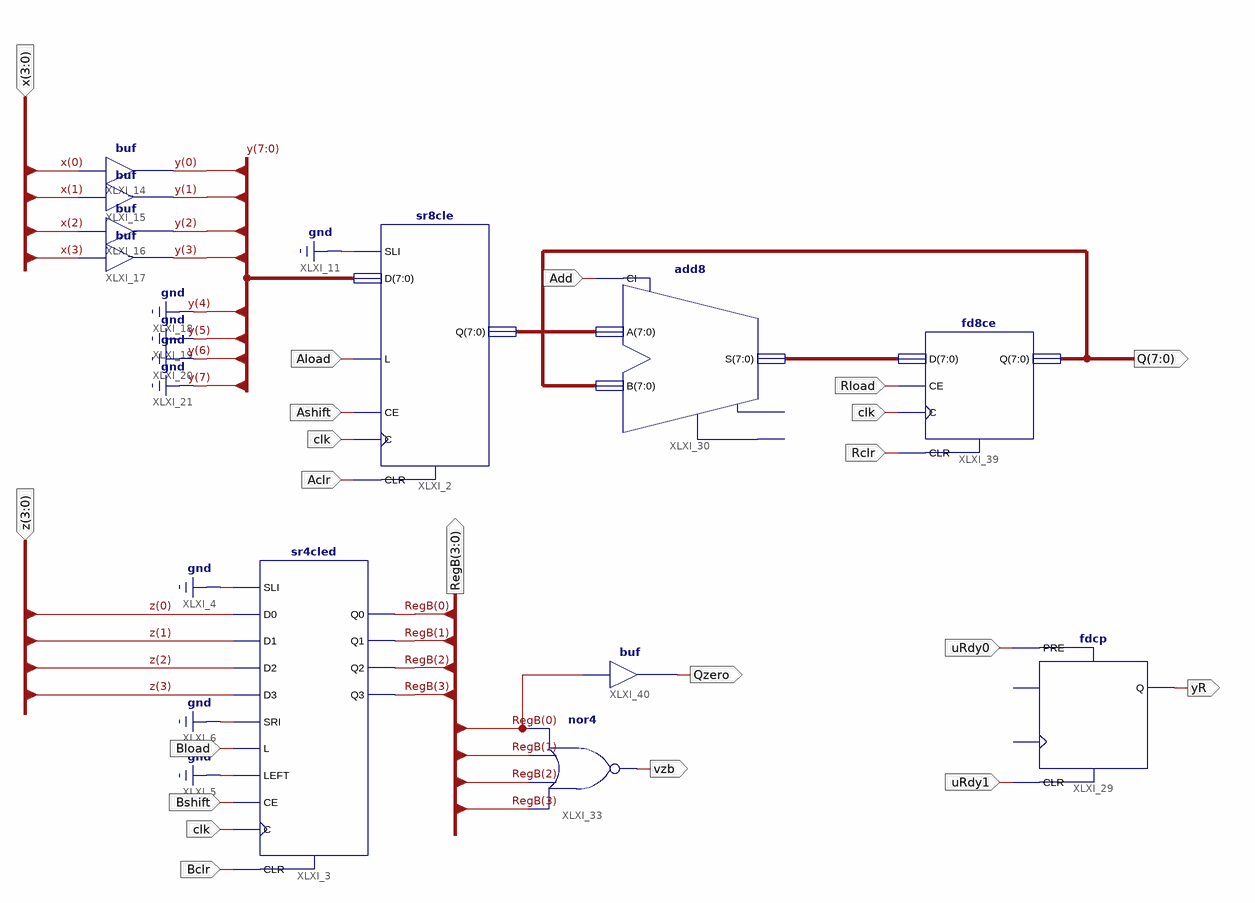
[diagram p0: schematic sheet 1]
// Xilinx ISE schematic PartC.sch (spartan3a) as structural Verilog: 11 symbols, 19 ports
module PartC (
  input  clk,
  input  [3:0] x,
  input  Bclr,
  input  Bshift,
  input  Bload,
  input  Aclr,
  input  Ashift,
  input  Aload,
  input  Add,
  input  Rload,
  input  Rclr,
  input  uRdy1,
  input  uRdy0,
  input  [3:0] z,
  output [3:0] RegB,
  output vzb,
  output [7:0] Q,
  output yR,
  output Qzero
);

  wire [3:0] y;
  wire [7:0] XLXN_75, XLXN_79;

  buf XLXI_14 (y[0], x[0]);
  buf XLXI_15 (y[1], x[1]);
  buf XLXI_16 (y[2], x[2]);
  buf XLXI_17 (y[3], x[3]);
  sr4cled XLXI_3 (
    .C(clk), .CE(Bshift), .CLR(Bclr), .D0(z[0]), .D1(z[1]), .D2(z[2]), .D3(z[3]), .L(Bload), .LEFT(1'b0),
    .SLI(1'b0), .SRI(1'b0), .Q0(RegB[0]), .Q1(RegB[1]), .Q2(RegB[2]), .Q3(RegB[3]));
  nor XLXI_33 (vzb, RegB[3], RegB[2], RegB[1], RegB[0]);
  sr8cle XLXI_2 (.C(clk), .CE(Ashift), .CLR(Aclr), .D({4'b0000, y}), .L(Aload), .SLI(1'b0), .Q(XLXN_75));
  add8 XLXI_30 (.A(XLXN_75), .B(Q), .CI(Add), .S(XLXN_79));  // open: CO, OFL
  fd8ce XLXI_39 (.C(clk), .CE(Rload), .CLR(Rclr), .D(XLXN_79), .Q(Q));
  fdcp XLXI_29 (.CLR(uRdy1), .PRE(uRdy0), .Q(yR));  // open: C, D
  buf XLXI_40 (Qzero, RegB[0]);
endmodule
